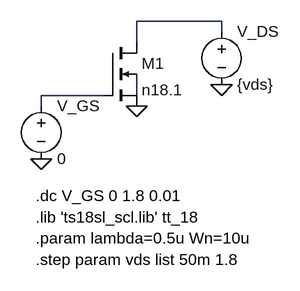
[diagram p0: schematic 2_e.asc]
2_e.asc, the LTspice schematic file:
Version 4
SHEET 1 880 680
WIRE 288 0 160 0
WIRE 288 16 288 0
WIRE 160 32 160 0
WIRE 112 112 16 112
WIRE 160 112 160 80
WIRE 16 128 16 112
FLAG 16 208 0
FLAG 160 128 0
FLAG 288 96 0
SYMBOL voltage 16 112 R0
WINDOW 123 0 0 Left 0
WINDOW 39 0 0 Left 0
SYMATTR InstName V_GS
SYMATTR Value 0
SYMBOL voltage 288 0 R0
WINDOW 123 0 0 Left 0
WINDOW 39 0 0 Left 0
SYMATTR InstName V_DS
SYMATTR Value {vds}
SYMBOL nmos4 112 32 R0
SYMATTR InstName M1
SYMATTR Value n18.1
SYMATTR Value2 l={2*lambda} w={Wn} ad={5*lambda*Wn} as={5*lambda*Wn} pd={2*Wn + 10*lambda} ps={2*Wn + 10*lambda}
TEXT 8 264 Left 2 !.dc V_GS 0 1.8 0.01
TEXT 8 328 Left 2 !.param lambda=0.5u Wn=10u
TEXT 8 296 Left 2 !.lib 'ts18sl_scl.lib' tt_18
TEXT 8 360 Left 2 !.step param vds list 50m 1.8

The netlist it stands for:
* 2_e.asc
V_GS N002 0 0
V_DS N001 0 {vds}
M1 N001 N002 0 N003 n18.1 l={2*lambda} w={Wn} ad={5*lambda*Wn} as={5*lambda*Wn} pd={2*Wn + 10*lambda} ps={2*Wn + 10*lambda}
.model NMOS NMOS
.model PMOS PMOS
.lib standard.mos
.dc V_GS 0 1.8 0.01
.param lambda=0.5u Wn=10u
.lib 'ts18sl_scl.lib' tt_18
.step param vds list 50m 1.8
.backanno
.end